# Altium schematic sheet GR_LED.SchDoc
size A4
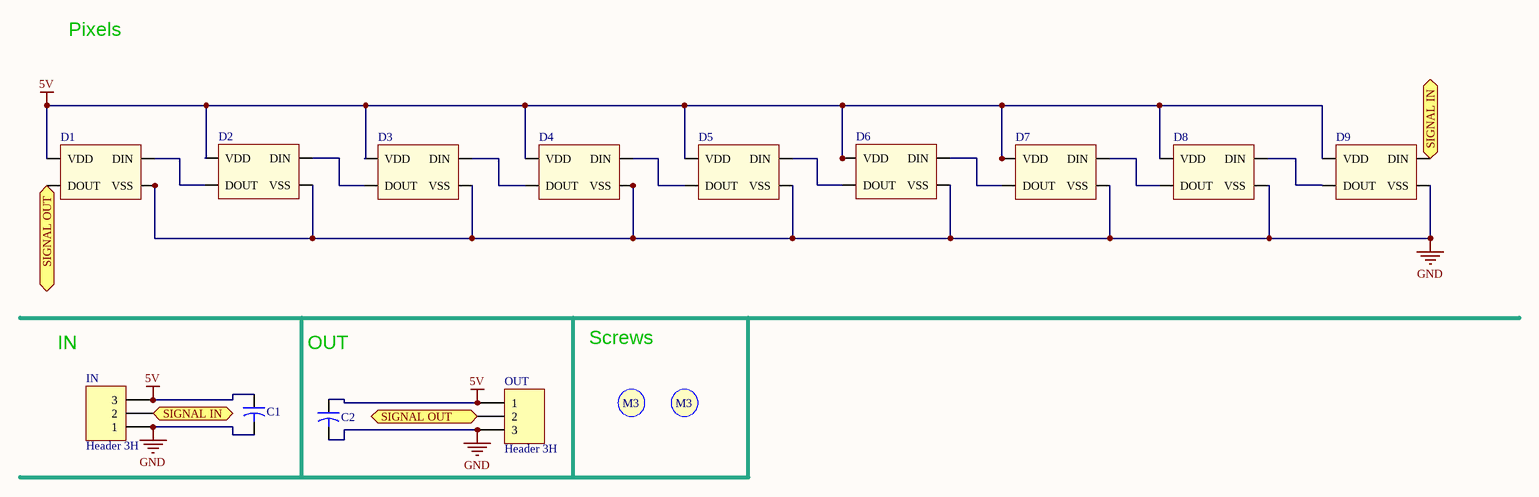
[diagram p0: GR_LED.SchDoc]

## Parts
C1  Cap2  [3.2X1.6X1.1]  (value not drawn)
C2  Cap2  [3.2X1.6X1.1]  (value not drawn)
D1  NeoPixel  [Neopixel]  (value not drawn)
D2  NeoPixel  [Neopixel]  (value not drawn)
D3  NeoPixel  [Neopixel]  (value not drawn)
D4  NeoPixel  [Neopixel]  (value not drawn)
D5  NeoPixel  [Neopixel]  (value not drawn)
D6  NeoPixel  [Neopixel]  (value not drawn)
D7  NeoPixel  [Neopixel]  (value not drawn)
D8  NeoPixel  [Neopixel]  (value not drawn)
D9  NeoPixel  [Neopixel]  (value not drawn)
IN  Header 3H  [Molex SPOX 3x1H]
OUT  Header 3H  [Molex SPOX 3x1H]
S1  Screw M3  [Screw M3]  (value not drawn)
S2  Screw M3  [Screw M3]  (value not drawn)

## Ports
SIGNAL IN, SIGNAL OUT

## Nets
5V: C1.1 C2.1 D1.4(VDD) D2.4(VDD) D3.4(VDD) D4.4(VDD) D5.4(VDD) D6.4(VDD) D7.4(VDD) D8.4(VDD) D9.4(VDD) IN.3 OUT.1
GND: C1.2 C2.2 D1.2(VSS) D2.2(VSS) D3.2(VSS) D4.2(VSS) D5.2(VSS) D6.2(VSS) D7.2(VSS) D8.2(VSS) D9.2(VSS) IN.1 OUT.3
SIGNAL IN: D9.3(DIN) IN.2 ; port SIGNAL IN
SIGNAL OUT: D1.1(DOUT) OUT.2 ; port SIGNAL OUT
NetD1_3: D1.3(DIN) D2.1(DOUT)
NetD2_3: D2.3(DIN) D3.1(DOUT)
NetD3_3: D3.3(DIN) D4.1(DOUT)
NetD4_3: D4.3(DIN) D5.1(DOUT)
NetD5_3: D5.3(DIN) D6.1(DOUT)
NetD6_3: D6.3(DIN) D7.1(DOUT)
NetD7_3: D7.3(DIN) D8.1(DOUT)
NetD8_3: D8.3(DIN) D9.1(DOUT)

## Notes on the sheet
- Pixels
- IN
- OUT
- Screws
- (in symbol Screw M3) M3

## Library data of the parts
C1 C2 = Cap2: Capacitor; Value: 100pF; Published: 23-Sep-2002; PackageReference: CAPR5-4X5; Publisher: Altium Limited; PackageDescription: Capacitor; 2 Leads
D1-D9 = NeoPixel: pin to pad: 1>4 2>1 3>2 4>3
IN OUT = Header 3H: Header, 3-Pin, Right Angle; pin to pad: 1>3 3>1; LatestRevisionDate: 17-Jul-2002; LatestRevisionNote: Re-released for DXP Platform.; Publisher: Altium Limited